# Altium project SAMV71_Xplained_Ultra.PrjPCB (part 5 of 5)

## Sheet SAMV71_Xplained_Ultra_Audio.SchDoc: Audio
size A3; Organization: ATMEL Norway; Address1: Vestre Rosten 79; Address2: N-7075 TILLER; Address3: NORWAY; DocumentNumber: A09-2407; Revision: 3; SheetNumber: 11; SheetTotal: 13; PageSetup: Record=PageOptions|CenterHorizontal=True|CenterVertical=True|PrintScale=1.01|XCorrection=1.00|YCorrection=1.00|PrintKind=1|BorderSize=5000000|LeftOffset=0|BottomOffset=0|Orientation=2|PaperLength=1000|PaperWidth=1000|Scale=100|PaperSource=7|PrintQuality=-4|MediaType=1|DitherType=10|PaperKind=A3 (297 x 420 mm)|PrintScaleMode=1
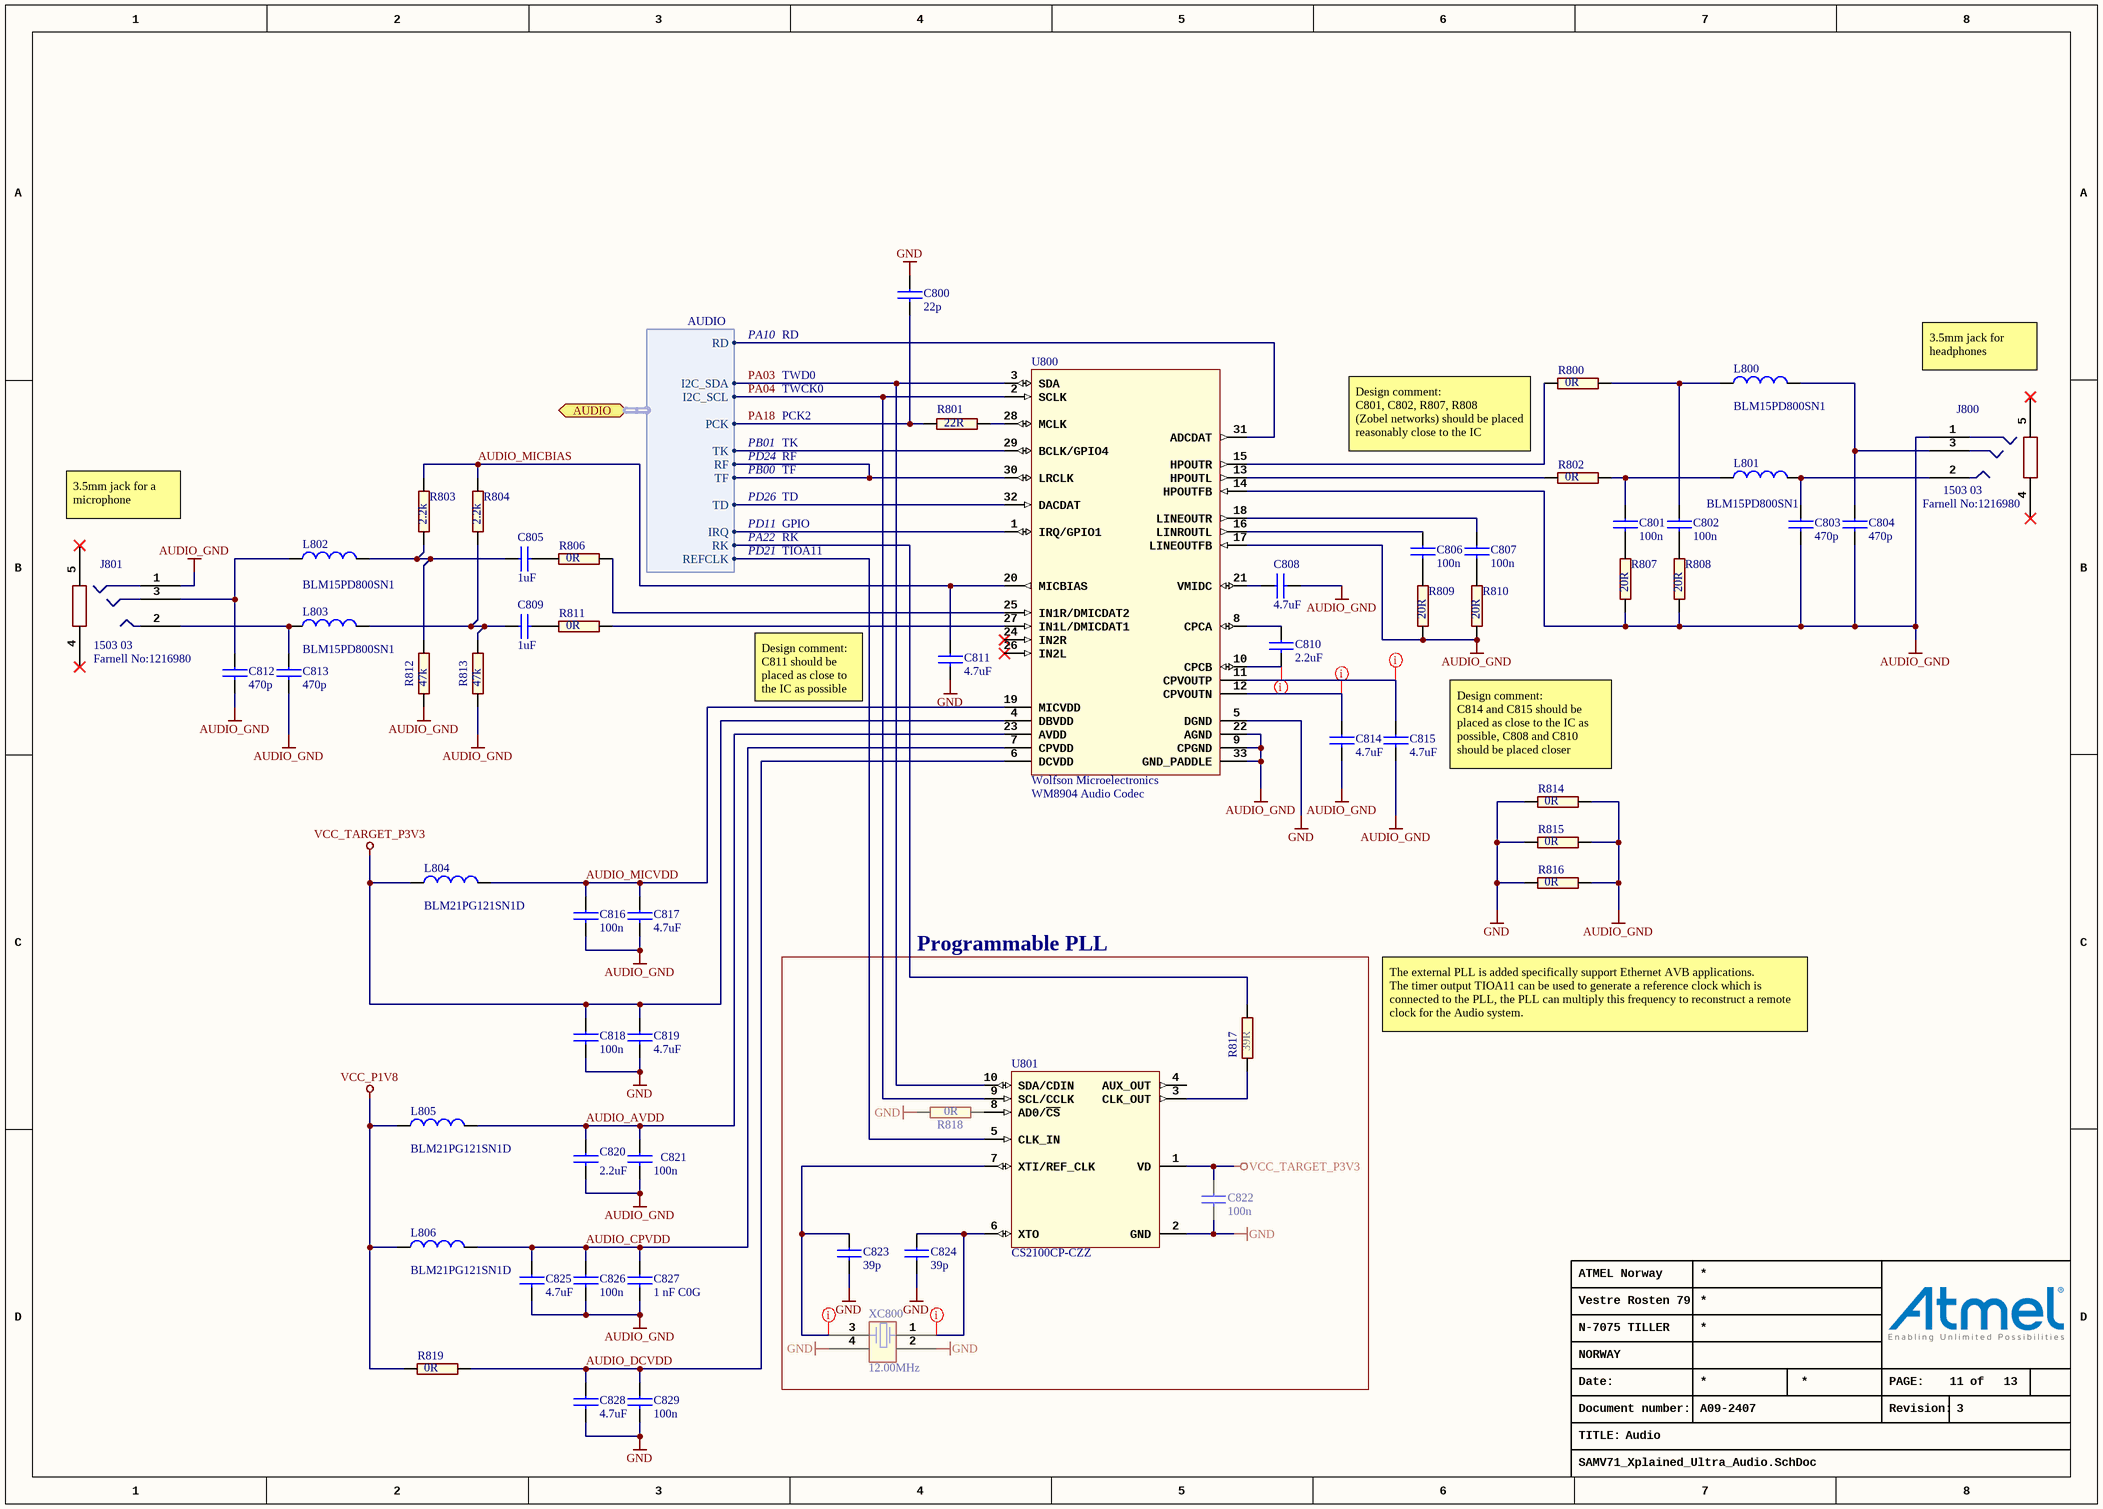
[diagram p10: SAMV71_Xplained_Ultra_Audio.SchDoc]

### Parts
C800  value 22p  [AP1-00001]
C801  value 100n  [AP1-00001]
C802  value 100n  [AP1-00001]
C803  value 470p  [AP1-00001]
C804  value 470p  [AP1-00001]
C805  value 1uF  [AP1-00038]
C806  value 100n  [AP1-00001]
C807  value 100n  [AP1-00001]
C808  value 4.7uF  [AP1-00039]
C809  value 1uF  [AP1-00038]
C810  value 2.2uF  [AP1-00001]  (hidden comment: Farnell no: 1288200)
C811  value 4.7uF  [AP1-00039]
C812  value 470p  [AP1-00001]
C813  value 470p  [AP1-00001]
C814  value 4.7uF  [AP1-00001]
C815  value 4.7uF  [AP1-00001]
C816  value 100n  [AP1-00001]
C817  value 4.7uF  [AP1-00039]
C818  value 100n  [AP1-00001]
C819  value 4.7uF  [AP1-00039]
C820  value 2.2uF  [AP1-00001]  (hidden comment: Farnell no: 1288200)
C821  value 100n  [AP1-00001]
C822  value 100n  [AP1-00001]
C823  value 39p  [AP1-00001]
C824  value 39p  [AP1-00001]
C825  value 4.7uF  [AP1-00039]
C826  value 100n  [AP1-00001]
C827  value 1 nF C0G  [AP1-00001]
C828  value 4.7uF  [AP1-00039]
C829  value 100n  [AP1-00001]
J800  Farnell No:1216980  value 1503 03  [AP8-00397]
J801  Farnell No:1216980  value 1503 03  [AP8-00397]
L800  value BLM15PD800SN1  [AP3-00028]
L801  value BLM15PD800SN1  [AP3-00028]
L802  value BLM15PD800SN1  [AP3-00028]
L803  value BLM15PD800SN1  [AP3-00028]
L804  value BLM21PG121SN1D  [AP3-00104]
L805  value BLM21PG121SN1D  [AP3-00104]
L806  value BLM21PG121SN1D  [AP3-00104]
R800  value 0R  [AP2-00000]
R801  value 22R  [AP2-00000]
R802  value 0R  [AP2-00000]
R803  value 2.2k  [AP2-00000]
R804  value 2.2k  [AP2-00000]
R806  value 0R  [AP2-00000]
R807  value 20R  [AP2-00000]
R808  value 20R  [AP2-00000]
R809  value 20R  [AP2-00000]
R810  value 20R  [AP2-00000]
R811  value 0R  [AP2-00000]
R812  value 47k  [AP2-00000]
R813  value 47k  [AP2-00000]
R814  value 0R  [AP2-00000]
R815  value 0R  [AP2-00000]
R816  value 0R  [AP2-00000]
R817  value 39R  [AP2-00000]
R818  value 0R  [AP2-00000]
R819  value 0R  [AP2-00000]
U800  Wolfson Microelectronics  value WM8904 Audio Codec  [AP6-00420]
U801  value CS2100CP-CZZ  [AP6-00097]
XC800  value 12.00MHz  [AP7-00039]

### Blocks framed on the sheet
Programmable PLL: C822-C824 R817 R818 U801 XC800

### Ports
AUDIO (harness AUDIO)

### Harnesses
AUDIO: I2C_SDA, I2C_SCL, PCK, TK, RK, TF, RD, TD, IRQ, REFCLK, RF

### Nets
AUDIO_GND: C803.2 C804.2 C808.2 C812.2 C813.2 C814.2 C815.2 C816.2 C817.2 C820.2 C821.2 C825.2 C826.2 C827.2 J800.1(GND) J801.1(GND) R807.1 R808.1 R809.1 R810.1 R812.1 R813.1 R814.2 R815.2 R816.2 U800.9(CPGND) U800.14(HPOUTFB) U800.17(LINEOUTFB) U800.22(AGND) U800.33(GND_PADDLE)
GND: C800.1 C811.2 C818.2 C819.2 C822.2 C823.2 C824.2 C828.2 C829.2 R814.1 R815.1 R816.1 R818.1 U800.5(DGND) U801.2(GND) XC800.2 XC800.4
VCC_P1V8: L805.1 L806.1 R819.1
VCC_TARGET_P3V3: C818.1 C819.1 C822.1 L804.1 U800.4(DBVDD) U801.1(VD)
AUDIO_AVDD: C820.1 C821.1 L805.2 U800.23(AVDD)
AUDIO_CPVDD: C825.1 C826.1 C827.1 L806.2 U800.7(CPVDD)
AUDIO_DCVDD: C828.1 C829.1 R819.2 U800.6(DCVDD)
AUDIO_MICBIAS: C811.1 R803.2 R804.2 U800.20(MICBIAS)
AUDIO_MICVDD: C816.1 C817.1 L804.2 U800.19(MICVDD)
PA03: U800.3(SDA) U801.10(SDA/CDIN) ; port AUDIO.I2C_SDA
PA04: U800.2(SCLK) U801.9(SCL/CCLK) ; port AUDIO.I2C_SCL
PA18: C800.2 R801.1 ; port AUDIO.PCK
NetC801_1: C801.1 L801.1 R802.2
NetC801_2: C801.2 R807.2
NetC802_1: C802.1 L800.1 R800.2
NetC802_2: C802.2 R808.2
NetC803_1: C803.1 J800.2 L801.2
NetC804_1: C804.1 J800.3 L800.2
NetC805_1: C805.1 L802.2 R803.1 R812.2
NetC805_2: C805.2 R806.1
NetC806_1: C806.1 U800.16(LINROUTL)
NetC806_2: C806.2 R809.2
NetC807_1: C807.1 U800.18(LINEOUTR)
NetC807_2: C807.2 R810.2
NetC808_1: C808.1 U800.21(VMIDC)
NetC809_1: C809.1 L803.2 R804.1 R813.2
NetC809_2: C809.2 R811.1
NetC810_1: C810.1 U800.8(CPCA)
NetC810_2: C810.2 U800.10(CPCB)
NetC812_1: C812.1 J801.3 L802.1
NetC813_1: C813.1 J801.2 L803.1
NetC814_1: C814.1 U800.12(CPVOUTN)
NetC815_1: C815.1 U800.11(CPVOUTP)
NetC823_1: C823.1 U801.7(XTI/REF_CLK) XC800.3
NetC824_1: C824.1 U801.6(XTO) XC800.1
NetR200_2: U800.1(IRQ/GPIO1) ; port AUDIO.IRQ
NetR223_2: U800.30(LRCLK) ; port AUDIO.TF, port AUDIO.RF
NetR224_2: U800.29(BCLK/GPIO4) ; port AUDIO.TK
NetR225_2: R817.2 ; port AUDIO.RK
NetR228_2: U800.31(ADCDAT) ; port AUDIO.RD
NetR229_2: U800.32(DACDAT) ; port AUDIO.TD
NetR230_2: U801.5(CLK_IN) ; port AUDIO.REFCLK
NetR800_1: R800.1 U800.15(HPOUTR)
NetR801_2: R801.2 U800.28(MCLK)
NetR802_1: R802.1 U800.13(HPOUTL)
NetR806_2: R806.2 U800.25(IN1R/DMICDAT2)
NetR811_2: R811.2 U800.27(IN1L/DMICDAT1)
NetR817_1: R817.1 U801.3(CLK_OUT)
NetR818_2: R818.2 U801.8(AD0/~{CS})

Not connected (* = marked no-connect by the designer): J800 4* 5*; J801 4* 5*; U800 24(IN2R)* 26(IN2L)*; U801 4(AUX_OUT)

### Layout directives
rule Assembly Testpoint Usage [Testpoint - Not Allowed    Multiple - Not Allowed]; rule Fabrication Testpoint Usage [Testpoint - Not Allowed    Multiple - Not Allowed]: NetC823_1, NetC824_1
rule Fabrication Testpoint Usage [Testpoint - Not Allowed    Multiple - Not Allowed]; rule Assembly Testpoint Usage [Testpoint - Not Allowed    Multiple - Not Allowed]: NetC810_2, NetC814_1, NetC815_1

### Notes on the sheet
- PA10
- RD
- TWD0
- 3.5mm jack for headphones
- PB01
- TWCK0
- PCK2
- TK
- Design comment:
  C801, C802, R807, R808
  (Zobel networks) should be placed reasonably close to the IC
- 3.5mm jack for a microphone
- PD24
- PB00
- PD26
- RF
- TF
- TD
- PA22
- PD21
- PD11
- GPIO
- RK
- TIOA11
- Design comment:
  C811 should be placed as close to the IC as possible
- Design comment:
  C814 and C815 should be placed as close to the IC as possible, C808 and C810 should be placed closer
- The external PLL is added specifically support Ethernet AVB applications.
  The timer output TIOA11 can be used to generate a reference clock which is
  connected to the PLL, the PLL can multiply this frequency to reconstruct a remote
  clock for the Audio system.
- Date:
- PAGE:
- of
- TITLE:
- Document number:
- Revision:

### Library data of the parts
C800 = A01-0019: Ceramic capacitor, SMD 0402, NP0, 50V, +/-5%; PartGroup: Capacitors,Ceramic,SMD 0402; TemperatureRange: -55 - +125 deg C; AN: A01-0019; Tolerance: 50V, +/-5%; Height: 0,550000011920929
C801 C802 C806 C807 C816 C818 C821 C822 C826 C829 = A01-0246: Ceramic capacitor, SMD 0402, X7R, 16V, +/-10%; PartGroup: Capacitors,Ceramic,SMD 0402; Manufacturer: Kemet; MPN: C0402C104K4RACTU; TemperatureRange: -55 - +125 deg C; AN: A01-0246; Tolerance: 16V, +/-10%; Height: 0,5
C803 C804 C812 C813 = A01-0034: Ceramic capacitor, SMD 0402, X7R, 50V, +/-10%; PartGroup: Capacitors,Ceramic,SMD 0402; TemperatureRange: -55 - +125 deg C; AN: A01-0034; Tolerance: 50V, +/-10%; Height: 0,550000011920929
C805 C809 = A01-0447: Ceramic capacitor, SMD 0402, X5R, 10V, ±10 %; PartGroup: Capacitors,Ceramic,SMD 0402; Manufacturer: AVX; MPN: 0402ZD105KAT2A; AN: A01-0447; Height: 0,560000002384186
C808 C811 C817 C819 C825 C828 = A01-0377: Ceramic capacitor, SMD 0603, X5R, 10V, 10% (de31036); PartGroup: Capacitors,Ceramic,SMD 0603; Manufacturer: tdk; MPN: C1608X5R1A475K; TemperatureRange: -55 - +85 deg C; AN: A01-0377; Tolerance: 10%; Height: 0,800000011920929
C810 C820 = A01-0300: Ceramic capacitor, SMD 0402, X5R, 6.3V, +/-20%; PartGroup: Capacitors,Ceramic,SMD 0402; Manufacturer: Kemet; MPN: C0402C225M9PAC; Tolerance: Â±20%; TemperatureRange: -55Â°C to +85Â°C; AN: A01-0300; Height: 0,5
C814 C815 = A01-0347: Ceramic capacitor, SMD 0402, X5R, 6.3V, +/-20% (de33687); PartGroup: Capacitors,Ceramic,SMD 0402; Manufacturer: Murata; MPN: GRM155R60J475ME87D; Tolerance: +-20%; TemperatureRange: -55°C to +85°C; AN: A01-0347; Height: 0,5
C823 C824 = A01-0022: Ceramic capacitor, SMD 0402, NP0, 50V, +/-5%; PartGroup: Capacitors,Ceramic,SMD 0402; TemperatureRange: -55 - +125 deg C; AN: A01-0022; Tolerance: 50V, +/-5%; Height: 0,550000011920929
C827 = A01-0321: Ceramic capacitor, SMD 0402, C0G, 50V, +/-5%; PartGroup: Capacitors,Ceramic,SMD 0402; Manufacturer: Murata; MPN: GRM1555C1H102JA01D; Tolerance: 5%; AN: A01-0321; Height: 0,550000011920929
J800 J801 = A08-0886: 3.5mm stereo phone jack; PartGroup: Mechanical devices,Connectors,Other; Manufacturer: Lumberg; AN: A08-0886; Height: 5; MPN: 1503 03
L800-L803 = A03-0142: FERRITE CHIP 80 OHM 1500MA 0402; PartGroup: Inductors,EMI; Manufacturer: Murata; Tolerance: ±25%; TemperatureRange: -55 ° C to +125 ° C; AN: A03-0142; Height: 0,5; MPN: BLM15PD800SN1
L804-L806 = A03-0167: SMD EMI FERRITE 0805, Z=120 ohm(@100MHz), Max R(dc)=0.03 ohm, Max current=3A, (Digikey:490-5986-2-ND); PartGroup: Inductors,EMI; Manufacturer: Murata; TemperatureRange: -55 to +125Â°C; AN: A03-0167; Height: 0,899999976158142; MPN: BLM21PG121SN1D
R800 R802 R806 R811 R814-R816 R818 R819 = A02-0163: RES 0.0 OHM 1/16W 0402 SMD; PartGroup: Resistors,SMD,0402 1%; Manufacturer: (n/a); MPN: RMCF0402ZT0R00; Tolerance: 1 %; TemperatureRange: -55 - +125 deg C; AN: A02-0163; Height: 0,349999994039536
R801 = A02-0172: Thick film resistor, SMD 0402, 1/16W, 1% (de23607); PartGroup: Resistors,SMD,0402 1%; Manufacturer: Samsung; MPN: RC100SF22R0CS; TemperatureRange: -55 - +125 deg C; AN: A02-0172; Tolerance: 1 %; Height: 0,349999994039536
R803 R804 = A02-0220: Thick film resistor, SMD 0402, 1/16W, 1%; PartGroup: Resistors,SMD,0402 1%; TemperatureRange: -55 - +125 deg C; AN: A02-0220; Tolerance: 1 %; Height: 0,349999994039536
R807-R810 = A02-0171: Thick film resistor, SMD 0402, 1/16W, 1%; PartGroup: Resistors,SMD,0402 1%; TemperatureRange: -55 - +125 deg C; AN: A02-0171; Tolerance: 1 %; Height: 0,349999994039536
R812 R813 = A02-0252: Thick film resistor, SMD 0402, 1/16W, 1%; PartGroup: Resistors,SMD,0402 1%; TemperatureRange: -55 - +125 deg C; AN: A02-0252; Tolerance: 1 %; Height: 0,349999994039536
R817 = A02-0178: Thick film resistor, SMD 0402, 1/16W, 1%; PartGroup: Resistors,SMD,0402 1%; TemperatureRange: -55 - +125 deg C; AN: A02-0178; Tolerance: 1 %; Height: 0,349999994039536
U800 = A06-1156: Ultra Low Power Codec for Portable Audio Applications; PartGroup: Integrated Circuits,Special function,Mixed signal; MPN: WM8904CGEFL/RV; TemperatureRange: -40C to +85C; AN: A06-1156; Height: 0,800000011920929; Manufacturer: Wolfson microelectronics
U801 = A06-1177: Programmable Phase-Locked Loop Clock Generator; PartGroup: Integrated Circuits,Special function,Oscillator; Manufacturer: CIRRUS LOGIC; MPN: CS2100CP-CZZR; TemperatureRange: -10Â°C to +70Â°C; AN: A06-1177; Height: 1,10000002384186
XC800 = A07-0042: Fox FQ5032B 12.0MHz SMD crystal 738B-12; PartGroup: Frequency devices,Crystals,SMD; Manufacturer: Fox  Electronics; MPN: FQ5032B-12.000; Tolerance: Â±30ppm; TemperatureRange: 0Â°C ~ 70Â°C; AN: A07-0042; Height: 1,20000004768372

## Sheet SAMV71_Xplained_Ultra_MCU_Peripherals.SchDoc: Target MCU Peripherals
size A3; Organization: ATMEL Norway; Address1: Vestre Rosten 79; Address2: N-7075 TILLER; Address3: NORWAY; DocumentNumber: A09-2407; Revision: 3; SheetNumber: 6; SheetTotal: 13; PageSetup: Record=PageOptions|CenterHorizontal=True|CenterVertical=True|PrintScale=1.01|XCorrection=1.00|YCorrection=1.00|PrintKind=1|BorderSize=5000000|LeftOffset=0|BottomOffset=0|Orientation=2|PaperLength=1000|PaperWidth=1000|Scale=100|PaperSource=7|PrintQuality=-4|MediaType=1|DitherType=10|PaperKind=A3 (297 x 420 mm)|PrintScaleMode=1
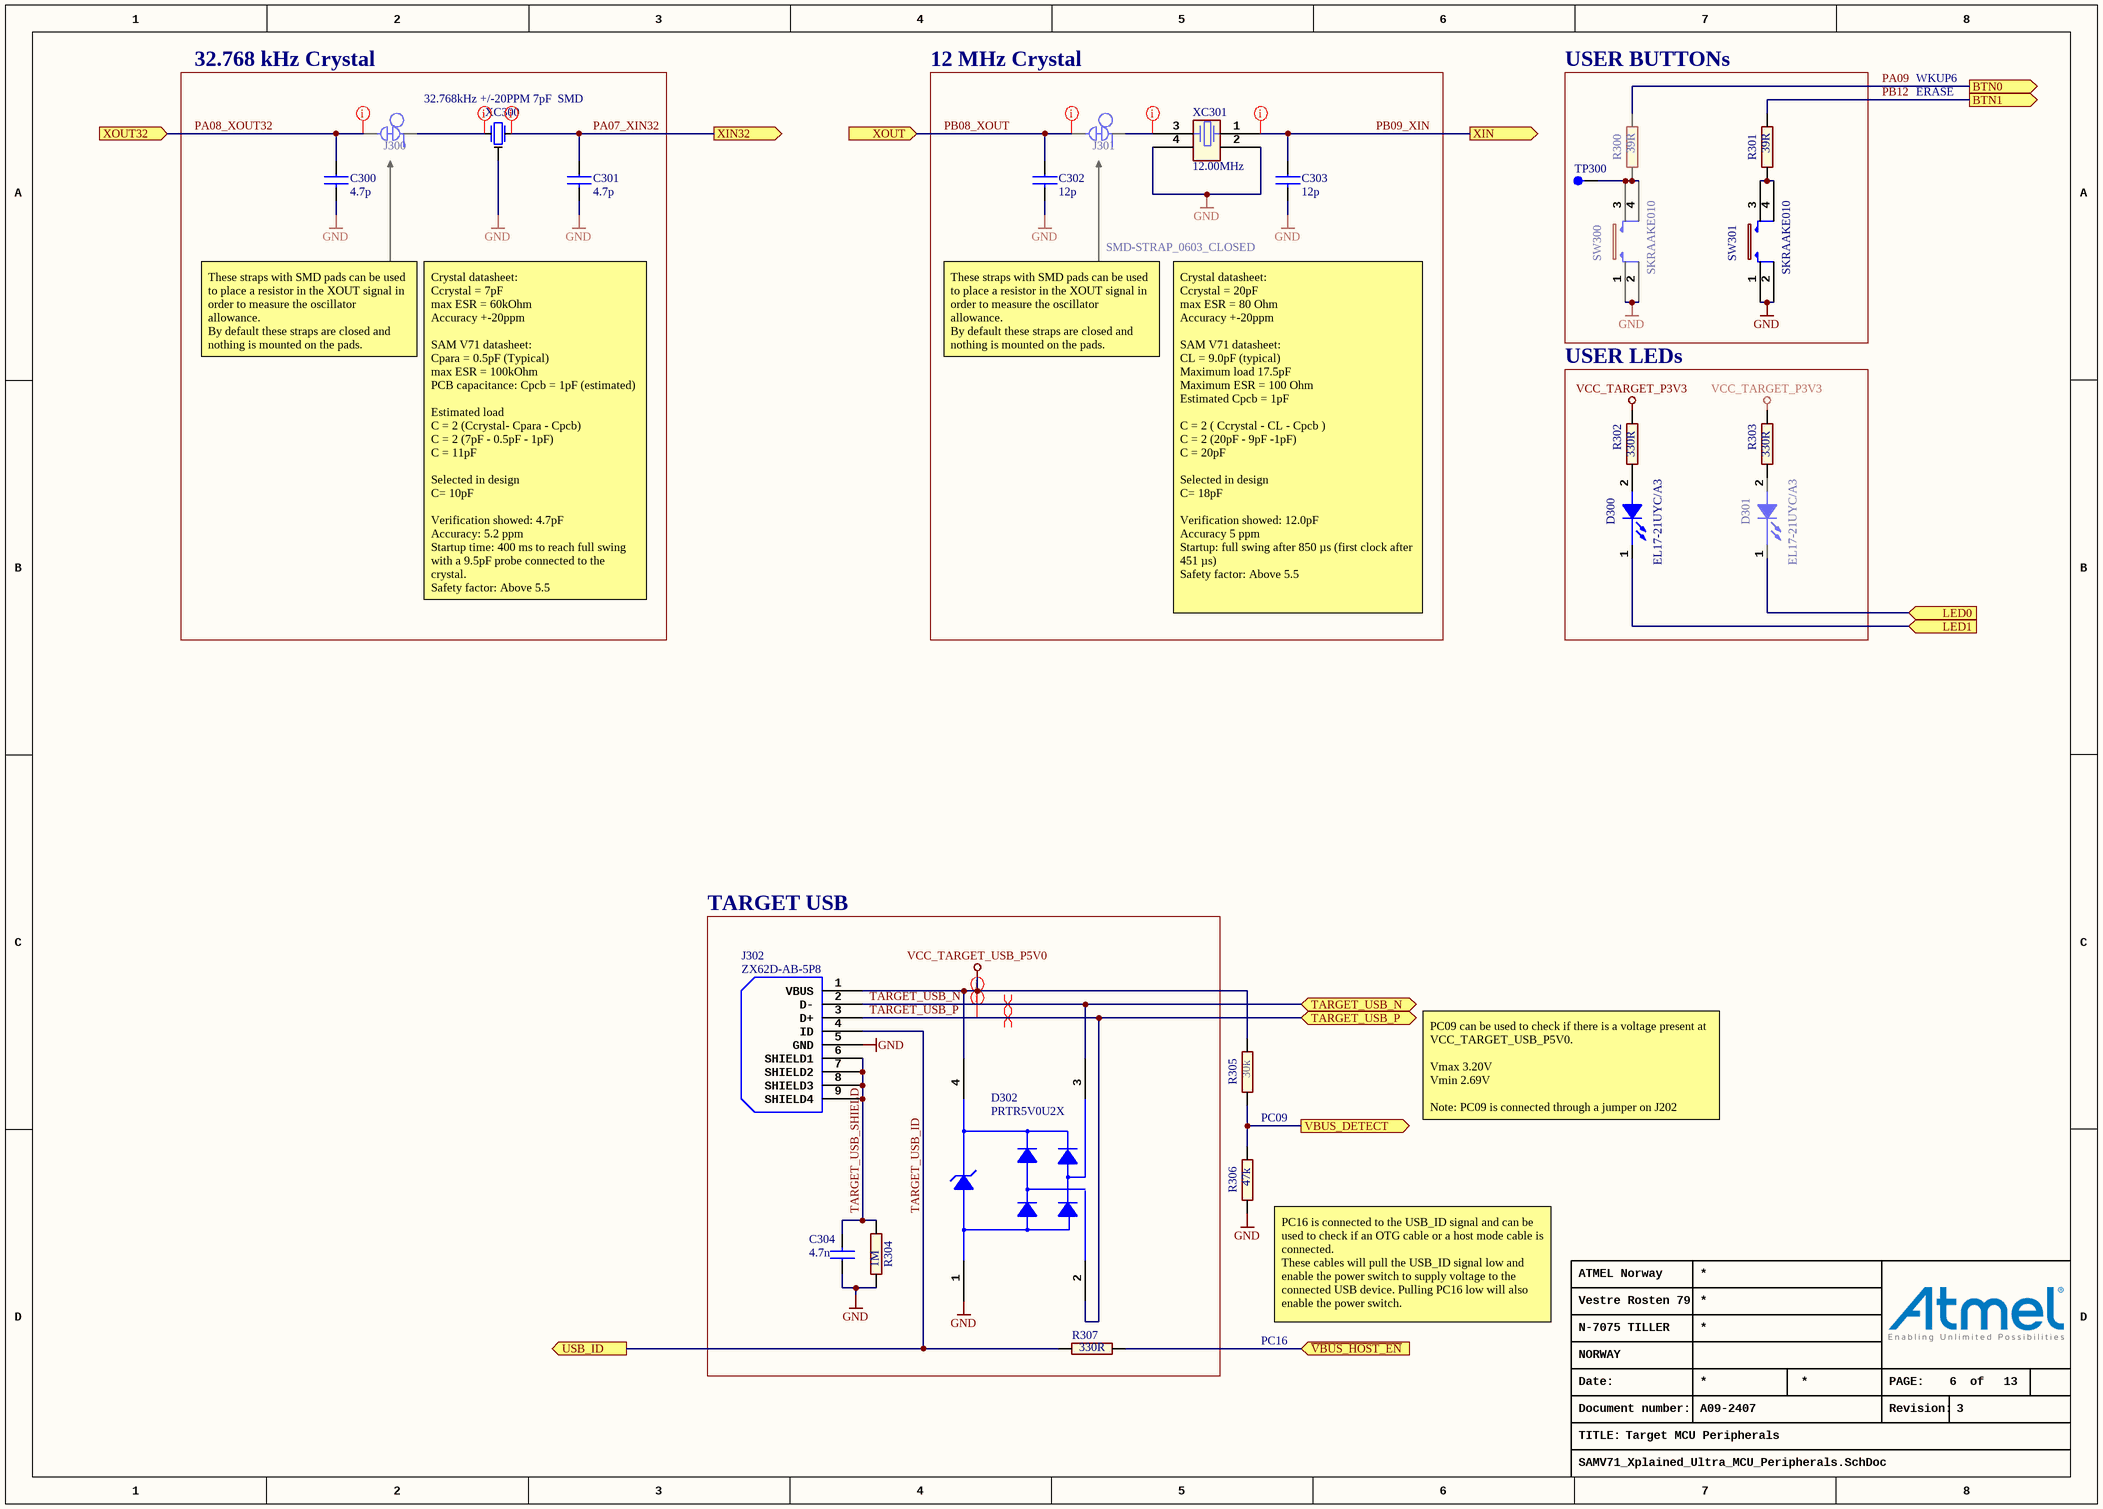
[diagram p11: SAMV71_Xplained_Ultra_MCU_Peripherals.SchDoc]

### Parts
C300  value 4.7p  [AP1-00001]
C301  value 4.7p  [AP1-00001]
C302  value 12p  [AP1-00001]
C303  value 12p  [AP1-00001]
C304  value 4.7n  [AP1-00053]
D300  value EL17-21UYC/A3  [AP4-00013]
D301  value EL17-21UYC/A3  [AP4-00013]
D302  value PRTR5V0U2X  [AP4-00001]
J300  (no value)  [AP9-00044]  (net tie, no BOM)
J301  value SMD-STRAP_0603_CLOSED  [AP9-00044]  (net tie, no BOM)
J302  value ZX62D-AB-5P8  [AP8-00852]  (hidden comment: 2,000 pieces per reel)
R300  value 39R  [AP2-00011]
R301  value 39R  [AP2-00011]
R302  value 330R  [AP2-00000]
R303  value 330R  [AP2-00000]
R304  value 1M  [AP2-00011]
R305  value 30k  [AP2-00000]
R306  value 47k  [AP2-00000]
R307  value 330R  [AP2-00000]
SW300  value SKRAAKE010  [AP8-00137]  (hidden comment: Can be ordered in low volumes from Mouser)
SW301  value SKRAAKE010  [AP8-00137]  (hidden comment: Can be ordered in low volumes from Mouser)
TP300  (no value)  [AP8-00010]  (no BOM)
XC300  value 32.768kHz +/-20PPM 7pF  SMD  [AP7-00044]  (hidden comment: Farnell order no:1539364)
XC301  value 12.00MHz  [AP7-00039]

### Blocks framed on the sheet
32.768 kHz Crystal: C300 C301 J300 XC300
12 MHz Crystal: C302 C303 J301 XC301
USER BUTTONs: R300 R301 SW300 SW301 TP300
USER LEDs: D300 D301 R302 R303
TARGET USB: C304 D302 J302 R304 R307

### Ports
BTN0 (out), BTN1 (out), LED0 (in), LED1 (in), TARGET_USB_N (bidir), TARGET_USB_P (bidir), USB_ID (out), VBUS_DETECT (out), XIN32 (out), XIN (out), XOUT32 (in), XOUT (in), ~{VBUS_HOST_EN} (in)

### Nets
GND: C300.2 C301.2 C302.2 C303.2 C304.1 D302.1(GND) J302.5(GND) R304.1 R306.1 SW300.1 SW300.2 SW301.1 SW301.2 XC300.3 XC301.2 XC301.4
VCC_TARGET_P3V3: R302.2 R303.2
VCC_TARGET_USB_P5V0: D302.4(VCC) J302.1(VBUS) R305.2
PA07_XIN32: C301.1 XC300.2 ; port XIN32
PA08_XOUT32: C300.1 J300.2 ; port XOUT32
PA09: R300.2 ; port BTN0
PA23: D301.1(CATHODE) ; port LED0
PB08_XOUT: C302.1 J301.2 ; port XOUT
PB09_XIN: C303.1 XC301.1 ; port XIN
PB12: R301.2 ; port BTN1
PC09_LED: D300.1(CATHODE) ; port LED1
PC09_VBUS_DETECT: R305.1 R306.2 ; port VBUS_DETECT
PC16: R307.2 ; port ~{VBUS_HOST_EN}
TARGET_USB_ID: J302.4(ID) R307.1 ; port USB_ID
TARGET_USB_N: D302.3(I/O_2) J302.2(D-) ; port TARGET_USB_N
TARGET_USB_P: D302.2(I/O_1) J302.3(D+) ; port TARGET_USB_P
TARGET_USB_SHIELD: C304.2 J302.6(SHIELD1) J302.7(SHIELD2) J302.8(SHIELD3) J302.9(SHIELD4) R304.2
NetD300_2: D300.2(ANODE) R302.1
NetD301_2: D301.2(ANODE) R303.1
NetJ300_1: J300.1 XC300.1
NetJ301_1: J301.1 XC301.3
NetR300_1: R300.1 SW300.3 SW300.4 TP300.1
NetR301_1: R301.1 SW301.3 SW301.4

### Layout directives
differential pair: TARGET_USB_N, TARGET_USB_P
rule Assembly Testpoint Usage [Testpoint - Not Allowed    Multiple - Not Allowed]; rule Fabrication Testpoint Usage [Testpoint - Not Allowed    Multiple - Not Allowed]: NetJ300_1, NetJ301_1, PA07_XIN32, PA08_XOUT32, PB08_XOUT, PB09_XIN, TARGET_USB_N, TARGET_USB_P

### Notes on the sheet
- WKUP6
- ERASE
- These straps with SMD pads can be used to place a resistor in the XOUT signal in order to measure the oscillator allowance.
  By default these straps are closed and nothing is mounted on the pads.
- Crystal datasheet:
  Ccrystal = 7pF
  max ESR = 60kOhm
  Accuracy +-20ppm
  SAM V71 datasheet:
  Cpara = 0.5pF (Typical)
  max ESR = 100kOhm
  PCB capacitance: Cpcb = 1pF (estimated)
  Estimated load
  C = 2 (Ccrystal- Cpara - Cpcb)
  C = 2 (7pF - 0.5pF - 1pF)
  C = 11pF
  Selected in design
  C= 10pF
  Verification showed: 4.7pF
  Accuracy: 5.2 ppm
  Startup time: 400 ms to reach full swing with a 9.5pF probe connected to the crystal.
  Safety factor: Above 5.5
- Crystal datasheet:
  Ccrystal = 20pF
  max ESR = 80 Ohm
  Accuracy +-20ppm
  SAM V71 datasheet:
  CL = 9.0pF (typical)
  Maximum load 17.5pF
  Maximum ESR = 100 Ohm
  Estimated Cpcb = 1pF
  C = 2 ( Ccrystal - CL - Cpcb )
  C = 2 (20pF - 9pF -1pF)
  C = 20pF
  Selected in design
  C= 18pF
  Verification showed: 12.0pF
  Accuracy 5 ppm
  Startup: full swing after 850 µs (first clock after 451 µs)
  Safety factor: Above 5.5
- PC09
- PC09 can be used to check if there is a voltage present at VCC_TARGET_USB_P5V0.
  Vmax 3.20V
  Vmin 2.69V
  Note: PC09 is connected through a jumper on J202
- (near R306) PC16 is connected to the USB_ID signal and can be used to check if an OTG cable or a host mode cable is connected.
  These cables will pull the USB_ID signal low and enable the power switch to supply voltage to the connected USB device. Pulling PC16 low will also enable the power switch.
- PC16
- Date:
- PAGE:
- of
- TITLE:
- Document number:
- Revision:

### Library data of the parts
C300 C301 = A01-0011: Ceramic capacitor, SMD 0402, NP0, 50V, +/-0.25pF; PartGroup: Capacitors,Ceramic,SMD 0402; TemperatureRange: -55 - +125 deg C; AN: A01-0011; Tolerance: 50V, +/-0.25pF; Height: 0,550000011920929
C302 C303 = A01-0016: Ceramic capacitor, SMD 0402, NP0, 50V, +/-5%; PartGroup: Capacitors,Ceramic,SMD 0402; TemperatureRange: -55 - +125 deg C; AN: A01-0016; Tolerance: 50V, +/-5%; Height: 0,550000011920929
C304 = A01-0046: Ceramic capacitor, SMD 0402, X7R, 25V, +/-10%; PartGroup: Capacitors,Ceramic,SMD 0402; TemperatureRange: -55 - +125 deg C; AN: A01-0046; Tolerance: 25V, +/-10%; Height: 0,550000011920929
D300 D301 = A10-0019: LED, Yellow, Wave length=591nm, SMD 0805, ±70°; PartGroup: Opto,LEDs,SMD; Manufacturer: Everlight; MPN: 17-21UYC/S530-A3/TR8; TemperatureRange: -40 to +85 deg C; AN: A10-0019; Height: 1,10000002384186
D302 = A06-0236: Double rail-to-rail USB ESD protection diode; OrcadPartType: Integrated Circuits&Special function&Protection; Manufacturer: NXP; PartGroup: Integrated Circuits,Special function,Protection; TemperatureRange: -40 to +85 C; AN: A06-0236; PartType: Buy; Height: 1,10000002384186; MPN: PRTR5V0U2X
J300 = A09-0783: Default closed SMD strap, 0603 size; PartGroup: Mechanical devices,PCB implemented components; Value: SMD-STRAP_0603_CLOSED; AN: A09-0783; Height: 0
J301 = A09-0783: Default closed SMD strap, 0603 size; PartGroup: Mechanical devices,PCB implemented components; AN: A09-0783; Height: 0
J302 = A08-2112: Micro USB AB Connector, Standard SMT + DIP; PartGroup: Mechanical devices,Connectors,USB; Manufacturer: HIROSE; AN: A08-2112; Height: 2,79999995231628; MPN: ZX62D-AB-5P8
R300 R301 = A02-0178: as R817 on sheet SAMV71_Xplained_Ultra_Audio; AN: A02-0178; Tolerance: 1 %; Height: 0,349999994039536
R302 R303 R307 = A02-0200: Thick film resistor, SMD 0402, 1/16W, 1%; PartGroup: Resistors,SMD,0402 1%; TemperatureRange: -55 - +125 deg C; AN: A02-0200; Tolerance: 1 %; Height: 0,349999994039536
R304 = A02-0284: Thick film resistor, SMD 0402, 1/16W, 1%; PartGroup: Resistors,SMD,0402 1%; TemperatureRange: -55 - +125 deg C; AN: A02-0284; Tolerance: 1 %; Height: 0,349999994039536
R305 = A02-0247: Thick film resistor, SMD 0402, 1/16W, 1%; PartGroup: Resistors,SMD,0402 1%; TemperatureRange: -55ï¿½ to +155ï¿½C; AN: A02-0247; Tolerance: 1 %; Height: 0,349999994039536
R306 = A02-0252: as R812 on sheet SAMV71_Xplained_Ultra_Audio; AN: A02-0252; Tolerance: 1 %; Height: 0,349999994039536
SW300 SW301 = A08-0790: 6.2x6.2 mm SMD tact switch, same as A08-0091 but less force is needed; PartGroup: Mechanical devices,Switches,SMD; Manufacturer: ALPS; TemperatureRange: -30 - +90 deg C; AN: A08-0790; Height: 5,09999990463257; MPN: SKRAAKE010
TP300 = A08-0004: Single SMD testpad; PartGroup: Mechanical devices,Connectors,Test points; AN: A08-0004; Height: 0; Value: TESTPAD
XC300 = A07-0052: 32k768 crystal, +-20ppm, CL=7pF, max ESR 60kOhm, SMD; PartGroup: Frequency devices,Crystals,SMD; Manufacturer: Micro Crystal; MPN: MS1V-T1K 32.768kHz 7pF +/-20PPM TA; Tolerance: +/- 20 PPM; TemperatureRange: -40 /+85; AN: A07-0052; Height: 2,07999992370605
XC301 = A07-0042: as XC800 on sheet SAMV71_Xplained_Ultra_Audio; AN: A07-0042; Height: 1,20000004768372

## Sheet SAMV71_Xplained_Ultra_CAN.SchDoc: CAN
size A3; Organization: ATMEL Norway; Address1: Vestre Rosten 79; Address2: N-7075 TILLER; Address3: NORWAY; DocumentNumber: A09-2407; Revision: 3; SheetNumber: 12; SheetTotal: 13; PageSetup: Record=PageOptions|CenterHorizontal=True|CenterVertical=True|PrintScale=1.01|XCorrection=1.00|YCorrection=1.00|PrintKind=1|BorderSize=5000000|LeftOffset=0|BottomOffset=0|Orientation=2|PaperLength=1000|PaperWidth=1000|Scale=100|PaperSource=7|PrintQuality=-4|MediaType=1|DitherType=10|PaperKind=A3 (297 x 420 mm)|PrintScaleMode=1; ProjectName: SAM3X Xplained Pro
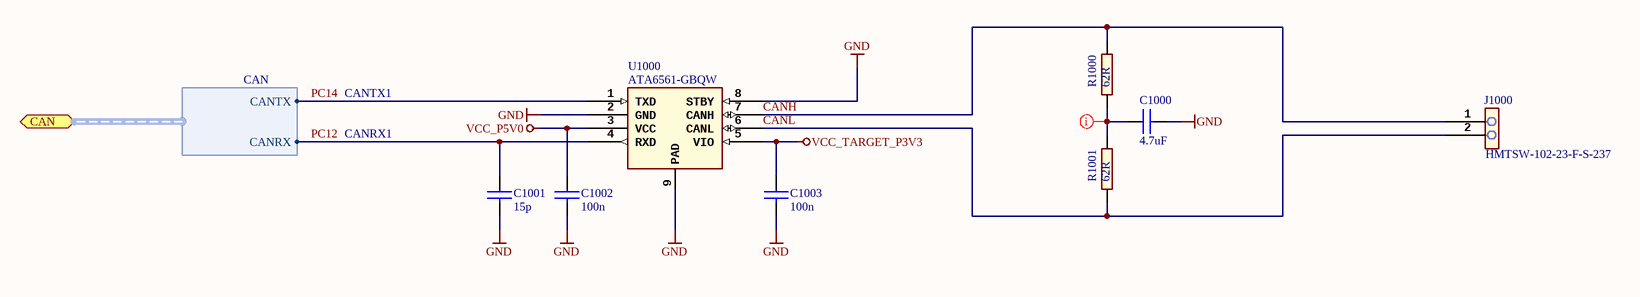
[diagram p12: SAMV71_Xplained_Ultra_CAN.SchDoc]

### Parts
C1000  value 4.7uF  [AP1-00003]
C1001  value 15p  [AP1-00001]
C1002  value 100n  [AP1-00001]
C1003  value 100n  [AP1-00001]
J1000  value HMTSW-102-23-F-S-237  [AP8-00733]
R1000  value 62R  [AP2-00008]  (hidden comment: Generic component)
R1001  value 62R  [AP2-00008]  (hidden comment: Generic component)
U1000  value ATA6561-GBQW  [AP6-00407]

### Ports
CAN (harness CAN)

### Harnesses
CAN: CANTX, CANRX

### Nets
GND: C1000.2 C1001.2 C1002.2 C1003.2 U1000.2(GND) U1000.8(STBY) U1000.9(PAD)
VCC_P5V0: C1002.1 U1000.3(VCC)
VCC_TARGET_P3V3: C1003.1 U1000.5(VIO)
CANH: J1000.1 R1000.2 U1000.7(CANH)
CANL: J1000.2 R1001.1 U1000.6(CANL)
PC12: C1001.1 U1000.4(RXD) ; port CAN.CANRX
PC14: U1000.1(TXD) ; port CAN.CANTX
NetC1000_1: C1000.1 R1000.1 R1001.2

### Layout directives
rule Fabrication Testpoint Usage [Testpoint - Not Allowed    Multiple - Not Allowed]; rule Assembly Testpoint Usage [Testpoint - Not Allowed    Multiple - Not Allowed]: NetC1000_1

### Notes on the sheet
- CANTX1
- CANRX1
- Date:
- PAGE:
- of
- TITLE:
- Document number:
- Revision:

### Library data of the parts
C1000 = A01-0400: Ceramic capacitor, SMD 0805, X5R, 25V, ±10 %; PartGroup: Capacitors,Ceramic,SMD 0805; Manufacturer: Murata; MPN: GRM21BR61E475KA12L; Tolerance: Â±10%; AN: A01-0400; Height: 1,25
C1001 = A01-0017: Ceramic capacitor, SMD 0402, NP0, 50V, +/-5%; PartGroup: Capacitors,Ceramic,SMD 0402; TemperatureRange: -55 - +125 deg C; AN: A01-0017; Tolerance: 50V, +/-5%; Height: 0,550000011920929
C1002 C1003 = A01-0246: as C801 on sheet SAMV71_Xplained_Ultra_Audio; AN: A01-0246; Tolerance: 16V, +/-10%; Height: 0,5
J1000 = A08-1754: 1x2 pin header, 2.54mm pitch, Pin-in-Paste THM; PartGroup: Mechanical devices,Connectors,Pin headers; Manufacturer: SAMTEC; TemperatureRange: - 55 deg C to + 125 deg C; AN: A08-1754; Height: 6,09999990463257; MPN: HMTSW-102-23-F-S-237
R1000 R1001 = A02-0760: Thick film resistor, SMD 1210, 0.5W, 1%; PartGroup: Resistors,SMD,1210 1%; TemperatureRange: -55°C to +155°C; AN: A02-0760; Tolerance: 1%; Height: 0,699999988079071
U1000 = A06-1172: 5Mbit/s CAN Trasceiver,VCC = 5V, VIO = 2.8-5V, 3x3 mm VDFN8; PartGroup: Integrated Circuits,Interface ICs,CAN; Manufacturer: ATMEL; AN: A06-1172; Height: 0,899999976158142; MPN: ATA6561-GBQW

## Nets that join several sheets
GND: SAMV71_Xplained_Ultra_Target_MCU (28 pins), SAMV71_Xplained_Ultra_EDBG (35 pins), SAMV71_Xplained_Ultra_Connectors (40 pins), SAMV71_Xplained_Ultra_Power_Supply (35 pins), SAMV71_Xplained_Ultra_Power_Multiplexer (9 pins), SAMV71_Xplained_Ultra_Power_Converter (24 pins), SAMV71_Xplained_Ultra_Ethernet (27 pins), SAMV71_Xplained_Ultra_Memory (33 pins), SAMV71_Xplained_Ultra_Shield_Connectors (6 pins), SAMV71_Xplained_Ultra_Audio (17 pins), SAMV71_Xplained_Ultra_MCU_Peripherals (16 pins), SAMV71_Xplained_Ultra_CAN (7 pins)
VCC_BACKUP_P3V3: SAMV71_Xplained_Ultra_Power_Supply (J102.2 R106.2 U101.1), SAMV71_Xplained_Ultra_Power_Converter (Q106.2 R127.2)
VCC_EDBG_P3V3: SAMV71_Xplained_Ultra_EDBG (24 pins), SAMV71_Xplained_Ultra_Power_Supply (Q101.2 Q108.2 R141.2)
VCC_EDBG_USB_P5V0: SAMV71_Xplained_Ultra_EDBG (C908.1 L900.2 U900.A10), SAMV71_Xplained_Ultra_Power_Multiplexer (C105.1 R116.2 U102.3 U102.8)
VCC_EXT_P5V0_P14V0: SAMV71_Xplained_Ultra_Connectors (J405.40), SAMV71_Xplained_Ultra_Power_Supply (6 pins), SAMV71_Xplained_Ultra_Shield_Connectors (J501.8)
VCC_IN_P5V0: SAMV71_Xplained_Ultra_Power_Supply (5 pins), SAMV71_Xplained_Ultra_Power_Multiplexer (Q104.3 R115.2 U102.2)
VCC_MCU_P3V3: SAMV71_Xplained_Ultra_Target_MCU (18 pins), SAMV71_Xplained_Ultra_Power_Supply (J102.1)
VCC_P1V2: SAMV71_Xplained_Ultra_Power_Converter (C120.1 R132.2 U104.23), SAMV71_Xplained_Ultra_Ethernet (6 pins)
VCC_P1V8: SAMV71_Xplained_Ultra_Power_Supply (R136.2), SAMV71_Xplained_Ultra_Power_Converter (C119.1 R128.2 U104.20), SAMV71_Xplained_Ultra_Audio (L805.1 L806.1 R819.1)
VCC_P3V3: SAMV71_Xplained_Ultra_EDBG (R920.2), SAMV71_Xplained_Ultra_Power_Supply (R100.1), SAMV71_Xplained_Ultra_Power_Converter (C116.1 C117.1 L102.2 R124.2)
VCC_P5V0: SAMV71_Xplained_Ultra_Power_Supply (5 pins), SAMV71_Xplained_Ultra_Power_Multiplexer (5 pins), SAMV71_Xplained_Ultra_Power_Converter (16 pins), SAMV71_Xplained_Ultra_Shield_Connectors (J501.5 J506.2 J507.1 J507.2), SAMV71_Xplained_Ultra_CAN (C1002.1 U1000.3)
VCC_TARGET_P3V3: SAMV71_Xplained_Ultra_Target_MCU (J200.1 R231.1 R232.1), SAMV71_Xplained_Ultra_Connectors (13 pins), SAMV71_Xplained_Ultra_Power_Supply (J101.4 R100.2 R102.2 U101.2), SAMV71_Xplained_Ultra_Power_Multiplexer (R120.1 R121.2), SAMV71_Xplained_Ultra_Power_Converter (R134.2), SAMV71_Xplained_Ultra_Ethernet (17 pins), SAMV71_Xplained_Ultra_Memory (38 pins), SAMV71_Xplained_Ultra_Shield_Connectors (J501.2 J501.4), SAMV71_Xplained_Ultra_Audio (6 pins), SAMV71_Xplained_Ultra_MCU_Peripherals (R302.2 R303.2), SAMV71_Xplained_Ultra_CAN (C1003.1 U1000.5)
VCC_TARGET_USB_P5V0: SAMV71_Xplained_Ultra_Power_Multiplexer (C106.1 R117.2 U102.6 U103.1), SAMV71_Xplained_Ultra_MCU_Peripherals (D302.4 J302.1 R305.2)
ADVREF: SAMV71_Xplained_Ultra_Target_MCU (C218.1 L200.2 U200.9), SAMV71_Xplained_Ultra_Shield_Connectors (J500.8)
EDBG_ADC0: SAMV71_Xplained_Ultra_EDBG (U900.K10), SAMV71_Xplained_Ultra_Power_Supply (R102.1 R103.2)
EDBG_TARGET_RESET: SAMV71_Xplained_Ultra_EDBG (U900.B4), SAMV71_Xplained_Ultra_Power_Supply (Q101.3)
ID1: SAMV71_Xplained_Ultra_EDBG (R903.1 U900.A1), SAMV71_Xplained_Ultra_Connectors (J401.1)
ID2: SAMV71_Xplained_Ultra_EDBG (R902.1 U900.B2), SAMV71_Xplained_Ultra_Connectors (J402.1)
ID4: SAMV71_Xplained_Ultra_EDBG (R901.1 U900.D3), SAMV71_Xplained_Ultra_Connectors (J404.1)
NetJ400_18: SAMV71_Xplained_Ultra_Target_MCU (R214.1), SAMV71_Xplained_Ultra_Connectors (J400.18)
NetJ401_13: SAMV71_Xplained_Ultra_Target_MCU (R201.2), SAMV71_Xplained_Ultra_Connectors (J401.13)
NetJ401_14: SAMV71_Xplained_Ultra_Target_MCU (R202.2), SAMV71_Xplained_Ultra_Connectors (J401.14)
NetJ401_18: SAMV71_Xplained_Ultra_Target_MCU (R204.2), SAMV71_Xplained_Ultra_Connectors (J401.18)
NetJ402_8: SAMV71_Xplained_Ultra_Target_MCU (R209.2), SAMV71_Xplained_Ultra_Connectors (J402.8)
NetJ402_18: SAMV71_Xplained_Ultra_Target_MCU (R212.2), SAMV71_Xplained_Ultra_Connectors (J402.18)
NetJ404_44: SAMV71_Xplained_Ultra_Target_MCU (R203.1), SAMV71_Xplained_Ultra_Connectors (J404.44)
NetJ500_6: SAMV71_Xplained_Ultra_Target_MCU (R205.2), SAMV71_Xplained_Ultra_Shield_Connectors (J500.6)
NetJ502_1: SAMV71_Xplained_Ultra_Target_MCU (R215.2), SAMV71_Xplained_Ultra_Shield_Connectors (J502.1)
NetJ502_6: SAMV71_Xplained_Ultra_Target_MCU (R216.2), SAMV71_Xplained_Ultra_Shield_Connectors (J502.6)
NetJ502_7: SAMV71_Xplained_Ultra_Target_MCU (R217.2), SAMV71_Xplained_Ultra_Shield_Connectors (J502.7)
NetJ502_8: SAMV71_Xplained_Ultra_Target_MCU (R218.2), SAMV71_Xplained_Ultra_Shield_Connectors (J502.8)
NetJ504_1: SAMV71_Xplained_Ultra_Target_MCU (R219.2), SAMV71_Xplained_Ultra_Shield_Connectors (J504.1)
NetJ504_2: SAMV71_Xplained_Ultra_Target_MCU (R220.2), SAMV71_Xplained_Ultra_Shield_Connectors (J504.2)
NetJ504_3: SAMV71_Xplained_Ultra_Target_MCU (R221.2), SAMV71_Xplained_Ultra_Shield_Connectors (J504.3)
NetJ504_4: SAMV71_Xplained_Ultra_Target_MCU (R222.2), SAMV71_Xplained_Ultra_Shield_Connectors (J504.4)
NetJ505_6: SAMV71_Xplained_Ultra_Target_MCU (R234.2), SAMV71_Xplained_Ultra_Shield_Connectors (J505.6)
NetJ505_7: SAMV71_Xplained_Ultra_Target_MCU (R208.2), SAMV71_Xplained_Ultra_Shield_Connectors (J505.7)
NetJ505_8: SAMV71_Xplained_Ultra_Target_MCU (R207.2), SAMV71_Xplained_Ultra_Shield_Connectors (J505.8)
NetJ506_3: SAMV71_Xplained_Ultra_Target_MCU (R227.2), SAMV71_Xplained_Ultra_Shield_Connectors (J506.3)
NetJ507_4: SAMV71_Xplained_Ultra_Target_MCU (R211.2), SAMV71_Xplained_Ultra_Shield_Connectors (J507.4)
NetJ507_5: SAMV71_Xplained_Ultra_Target_MCU (R213.2), SAMV71_Xplained_Ultra_Shield_Connectors (J507.5)
NetR200_2: SAMV71_Xplained_Ultra_Target_MCU (R200.2), SAMV71_Xplained_Ultra_Audio (U800.1)
NetR206_1: SAMV71_Xplained_Ultra_Target_MCU (R206.1), SAMV71_Xplained_Ultra_EDBG (U900.J4)
NetR223_2: SAMV71_Xplained_Ultra_Target_MCU (R223.2 R226.2), SAMV71_Xplained_Ultra_Audio (U800.30)
NetR224_2: SAMV71_Xplained_Ultra_Target_MCU (R224.2), SAMV71_Xplained_Ultra_Audio (U800.29)
NetR225_2: SAMV71_Xplained_Ultra_Target_MCU (R225.2), SAMV71_Xplained_Ultra_Audio (R817.2)
NetR228_2: SAMV71_Xplained_Ultra_Target_MCU (R228.2), SAMV71_Xplained_Ultra_Audio (U800.31)
NetR229_2: SAMV71_Xplained_Ultra_Target_MCU (R229.2), SAMV71_Xplained_Ultra_Audio (U800.32)
NetR230_2: SAMV71_Xplained_Ultra_Target_MCU (R230.2), SAMV71_Xplained_Ultra_Audio (U801.5)
~{PHY_RESET}: SAMV71_Xplained_Ultra_Target_MCU (U200.90), SAMV71_Xplained_Ultra_Ethernet (C713.1 R702.1 U700.28)
PA00: SAMV71_Xplained_Ultra_Target_MCU (U200.102), SAMV71_Xplained_Ultra_Connectors (J401.7), SAMV71_Xplained_Ultra_Shield_Connectors (J503.3)
PA01: SAMV71_Xplained_Ultra_Target_MCU (U200.99), SAMV71_Xplained_Ultra_Power_Converter (R134.1 U104.3)
PA02: SAMV71_Xplained_Ultra_Target_MCU (U200.93), SAMV71_Xplained_Ultra_EDBG (R914.1), SAMV71_Xplained_Ultra_Connectors (J402.9 J404.45 J405.16), SAMV71_Xplained_Ultra_Shield_Connectors (J503.8)
PA03: SAMV71_Xplained_Ultra_Target_MCU (R232.2 U200.91), SAMV71_Xplained_Ultra_EDBG (U900.G7), SAMV71_Xplained_Ultra_Connectors (5 pins), SAMV71_Xplained_Ultra_Memory (U600.5 U602.5 U603.5), SAMV71_Xplained_Ultra_Shield_Connectors (J500.9), SAMV71_Xplained_Ultra_Audio (U800.3 U801.10)
PA04: SAMV71_Xplained_Ultra_Target_MCU (R231.2 U200.77), SAMV71_Xplained_Ultra_EDBG (U900.F7), SAMV71_Xplained_Ultra_Connectors (5 pins), SAMV71_Xplained_Ultra_Memory (U600.6 U602.6 U603.6), SAMV71_Xplained_Ultra_Shield_Connectors (J500.10), SAMV71_Xplained_Ultra_Audio (U800.2 U801.9)
PA05: SAMV71_Xplained_Ultra_Target_MCU (U200.73), SAMV71_Xplained_Ultra_Connectors (J400.22 J401.10), SAMV71_Xplained_Ultra_Shield_Connectors (J500.1)
PA06: SAMV71_Xplained_Ultra_Target_MCU (U200.114), SAMV71_Xplained_Ultra_Connectors (J400.10 J402.5 J405.25), SAMV71_Xplained_Ultra_Shield_Connectors (J503.4)
PA07_XIN32: SAMV71_Xplained_Ultra_Target_MCU (U200.35), SAMV71_Xplained_Ultra_MCU_Peripherals (C301.1 XC300.2)
PA08_XOUT32: SAMV71_Xplained_Ultra_Target_MCU (U200.36), SAMV71_Xplained_Ultra_MCU_Peripherals (C300.1 J300.2)
PA09: SAMV71_Xplained_Ultra_Target_MCU (U200.75), SAMV71_Xplained_Ultra_EDBG (R911.1), SAMV71_Xplained_Ultra_Connectors (J400.21), SAMV71_Xplained_Ultra_MCU_Peripherals (R300.2)
PA11: SAMV71_Xplained_Ultra_Target_MCU (U200.64), SAMV71_Xplained_Ultra_Memory (R605.2 U604.1)
PA12: SAMV71_Xplained_Ultra_Target_MCU (U200.68), SAMV71_Xplained_Ultra_Memory (U604.2)
PA13: SAMV71_Xplained_Ultra_Target_MCU (U200.42), SAMV71_Xplained_Ultra_Memory (U604.5)
PA14: SAMV71_Xplained_Ultra_Target_MCU (U200.51), SAMV71_Xplained_Ultra_Memory (U604.6)
PA15: SAMV71_Xplained_Ultra_Target_MCU (U200.49), SAMV71_Xplained_Ultra_Connectors (J404.20), SAMV71_Xplained_Ultra_Memory (U601.B1)
PA16: SAMV71_Xplained_Ultra_Target_MCU (U200.45), SAMV71_Xplained_Ultra_Connectors (J404.21), SAMV71_Xplained_Ultra_Memory (U601.A2)
PA17: SAMV71_Xplained_Ultra_Target_MCU (U200.25), SAMV71_Xplained_Ultra_Memory (U604.3)
PA18: SAMV71_Xplained_Ultra_Target_MCU (U200.24), SAMV71_Xplained_Ultra_Shield_Connectors (J507.3), SAMV71_Xplained_Ultra_Audio (C800.2 R801.1)
PA19: SAMV71_Xplained_Ultra_Target_MCU (U200.23), SAMV71_Xplained_Ultra_Connectors (J401.4), SAMV71_Xplained_Ultra_Ethernet (R706.1 R720.1 U700.29), SAMV71_Xplained_Ultra_Shield_Connectors (J502.3)
PA20: SAMV71_Xplained_Ultra_Target_MCU (U200.22), SAMV71_Xplained_Ultra_Memory (U601.M1)
PA21: SAMV71_Xplained_Ultra_Target_MCU (U200.32), SAMV71_Xplained_Ultra_EDBG (R910.1), SAMV71_Xplained_Ultra_Connectors (J402.13), SAMV71_Xplained_Ultra_Shield_Connectors (J507.27)
PA23: SAMV71_Xplained_Ultra_Target_MCU (U200.46), SAMV71_Xplained_Ultra_EDBG (R912.1), SAMV71_Xplained_Ultra_MCU_Peripherals (D301.1)
PA24: SAMV71_Xplained_Ultra_Target_MCU (U200.56), SAMV71_Xplained_Ultra_Connectors (J400.16 J402.10), SAMV71_Xplained_Ultra_Shield_Connectors (J507.26)
PA25: SAMV71_Xplained_Ultra_Target_MCU (U200.59), SAMV71_Xplained_Ultra_Memory (J600.5), SAMV71_Xplained_Ultra_Shield_Connectors (J507.25)
PA26: SAMV71_Xplained_Ultra_Target_MCU (U200.62), SAMV71_Xplained_Ultra_Memory (J600.9 R608.1)
PA27: SAMV71_Xplained_Ultra_Target_MCU (U200.70), SAMV71_Xplained_Ultra_Connectors (J400.25), SAMV71_Xplained_Ultra_Memory (J600.1 R607.1)
PA28: SAMV71_Xplained_Ultra_Target_MCU (U200.112), SAMV71_Xplained_Ultra_Memory (J600.2 R606.1)
PA29: SAMV71_Xplained_Ultra_Target_MCU (U200.129), SAMV71_Xplained_Ultra_Ethernet (U700.32)
PA30: SAMV71_Xplained_Ultra_Target_MCU (U200.116), SAMV71_Xplained_Ultra_Memory (J600.7 R610.1)
PA31: SAMV71_Xplained_Ultra_Target_MCU (U200.118), SAMV71_Xplained_Ultra_Memory (J600.8 R609.1)
PB02: SAMV71_Xplained_Ultra_Target_MCU (U200.26), SAMV71_Xplained_Ultra_Connectors (J401.6 J405.34), SAMV71_Xplained_Ultra_Shield_Connectors (J504.8 J507.20)
PB03: SAMV71_Xplained_Ultra_Target_MCU (U200.31), SAMV71_Xplained_Ultra_Connectors (J400.20 J401.5 J405.27), SAMV71_Xplained_Ultra_Shield_Connectors (J504.7 J507.21)
PB04: SAMV71_Xplained_Ultra_Target_MCU (U200.105), SAMV71_Xplained_Ultra_EDBG (U900.F9), SAMV71_Xplained_Ultra_Connectors (J402.14 J405.2), SAMV71_Xplained_Ultra_Shield_Connectors (J507.28)
PB05: SAMV71_Xplained_Ultra_Target_MCU (U200.109), SAMV71_Xplained_Ultra_EDBG (R921.2), SAMV71_Xplained_Ultra_Connectors (J403.6 J405.10 R403.2)
PB06_SWDIO: SAMV71_Xplained_Ultra_Target_MCU (U200.79), SAMV71_Xplained_Ultra_EDBG (R905.2), SAMV71_Xplained_Ultra_Connectors (J403.2 R400.2)
PB07_SWCLK: SAMV71_Xplained_Ultra_Target_MCU (U200.89), SAMV71_Xplained_Ultra_EDBG (R904.2), SAMV71_Xplained_Ultra_Connectors (J403.4 R401.2)
PB08_XOUT: SAMV71_Xplained_Ultra_Target_MCU (U200.141), SAMV71_Xplained_Ultra_MCU_Peripherals (C302.1 J301.2)
PB09_XIN: SAMV71_Xplained_Ultra_Target_MCU (U200.142), SAMV71_Xplained_Ultra_MCU_Peripherals (C303.1 XC301.1)
PB12: SAMV71_Xplained_Ultra_Target_MCU (J200.2 U200.87), SAMV71_Xplained_Ultra_EDBG (R900.2), SAMV71_Xplained_Ultra_MCU_Peripherals (R301.2)
PB13: SAMV71_Xplained_Ultra_Target_MCU (U200.144), SAMV71_Xplained_Ultra_Connectors (J400.5), SAMV71_Xplained_Ultra_Shield_Connectors (J504.5)
PC00: SAMV71_Xplained_Ultra_Target_MCU (U200.11), SAMV71_Xplained_Ultra_Connectors (J404.3), SAMV71_Xplained_Ultra_Memory (U601.A6)
PC01: SAMV71_Xplained_Ultra_Target_MCU (U200.38), SAMV71_Xplained_Ultra_Connectors (J404.4), SAMV71_Xplained_Ultra_Memory (U601.B7)
PC02: SAMV71_Xplained_Ultra_Target_MCU (U200.39), SAMV71_Xplained_Ultra_Connectors (J404.5), SAMV71_Xplained_Ultra_Memory (U601.C7)
PC03: SAMV71_Xplained_Ultra_Target_MCU (U200.40), SAMV71_Xplained_Ultra_Connectors (J404.6), SAMV71_Xplained_Ultra_Memory (U601.D7)
PC04: SAMV71_Xplained_Ultra_Target_MCU (U200.41), SAMV71_Xplained_Ultra_Connectors (J404.8), SAMV71_Xplained_Ultra_Memory (U601.D6)
PC05: SAMV71_Xplained_Ultra_Target_MCU (U200.58), SAMV71_Xplained_Ultra_Connectors (J404.9), SAMV71_Xplained_Ultra_Memory (U601.E7)
PC06: SAMV71_Xplained_Ultra_Target_MCU (U200.54), SAMV71_Xplained_Ultra_Connectors (J404.10), SAMV71_Xplained_Ultra_Memory (U601.F7)
PC07: SAMV71_Xplained_Ultra_Target_MCU (U200.48), SAMV71_Xplained_Ultra_Connectors (J404.11), SAMV71_Xplained_Ultra_Memory (U601.G7)
PC08: SAMV71_Xplained_Ultra_Target_MCU (U200.82), SAMV71_Xplained_Ultra_Connectors (J404.35)
PC09_LED: SAMV71_Xplained_Ultra_Target_MCU (J202.1), SAMV71_Xplained_Ultra_Connectors (J404.46), SAMV71_Xplained_Ultra_Shield_Connectors (J500.2), SAMV71_Xplained_Ultra_MCU_Peripherals (D300.1)
PC09_VBUS_DETECT: SAMV71_Xplained_Ultra_Target_MCU (J202.3), SAMV71_Xplained_Ultra_MCU_Peripherals (R305.1 R306.2)
PC11: SAMV71_Xplained_Ultra_Target_MCU (U200.94), SAMV71_Xplained_Ultra_Connectors (J404.36)
PC12: SAMV71_Xplained_Ultra_Target_MCU (U200.17), SAMV71_Xplained_Ultra_Shield_Connectors (J507.33), SAMV71_Xplained_Ultra_CAN (C1001.1 U1000.4)
PC13: SAMV71_Xplained_Ultra_Target_MCU (U200.19), SAMV71_Xplained_Ultra_Connectors (J402.4 J404.47), SAMV71_Xplained_Ultra_Shield_Connectors (J502.5)
PC14: SAMV71_Xplained_Ultra_Target_MCU (U200.97), SAMV71_Xplained_Ultra_Shield_Connectors (J507.34), SAMV71_Xplained_Ultra_CAN (U1000.1)
PC15: SAMV71_Xplained_Ultra_Target_MCU (U200.18), SAMV71_Xplained_Ultra_Memory (R604.2 U601.L7)
PC16: SAMV71_Xplained_Ultra_Target_MCU (U200.100), SAMV71_Xplained_Ultra_MCU_Peripherals (R307.2)
PC17: SAMV71_Xplained_Ultra_Target_MCU (U200.103), SAMV71_Xplained_Ultra_Power_Converter (Q106.1 R127.1)
PC18: SAMV71_Xplained_Ultra_Target_MCU (U200.111), SAMV71_Xplained_Ultra_Memory (U601.J6)
PC19: SAMV71_Xplained_Ultra_Target_MCU (U200.117), SAMV71_Xplained_Ultra_Connectors (J400.6 J402.7), SAMV71_Xplained_Ultra_Shield_Connectors (J503.7)
PC20: SAMV71_Xplained_Ultra_Target_MCU (U200.120), SAMV71_Xplained_Ultra_Memory (U601.N6)
PC21: SAMV71_Xplained_Ultra_Target_MCU (U200.122), SAMV71_Xplained_Ultra_Memory (U601.P7)
PC22: SAMV71_Xplained_Ultra_Target_MCU (U200.124), SAMV71_Xplained_Ultra_Memory (U601.P6)
PC23: SAMV71_Xplained_Ultra_Target_MCU (U200.127), SAMV71_Xplained_Ultra_Memory (U601.R6)
PC24: SAMV71_Xplained_Ultra_Target_MCU (U200.130), SAMV71_Xplained_Ultra_Memory (U601.R2)
PC25: SAMV71_Xplained_Ultra_Target_MCU (U200.133), SAMV71_Xplained_Ultra_Memory (U601.P2)
PC26: SAMV71_Xplained_Ultra_Target_MCU (U200.13), SAMV71_Xplained_Ultra_Memory (U601.P1)
PC27: SAMV71_Xplained_Ultra_Target_MCU (U200.12), SAMV71_Xplained_Ultra_Memory (U601.N2)
PC28: SAMV71_Xplained_Ultra_Target_MCU (U200.76), SAMV71_Xplained_Ultra_Memory (U601.N1)
PC29: SAMV71_Xplained_Ultra_Target_MCU (U200.16), SAMV71_Xplained_Ultra_Memory (U601.M2)
PC30: SAMV71_Xplained_Ultra_Target_MCU (U200.15), SAMV71_Xplained_Ultra_Connectors (J401.8 J404.33)
PC31: SAMV71_Xplained_Ultra_Target_MCU (U200.14), SAMV71_Xplained_Ultra_Connectors (J401.3), SAMV71_Xplained_Ultra_Shield_Connectors (J502.2)
PD00: SAMV71_Xplained_Ultra_Target_MCU (U200.1), SAMV71_Xplained_Ultra_Ethernet (R711.1 U700.19), SAMV71_Xplained_Ultra_Shield_Connectors (J504.6)
PD01: SAMV71_Xplained_Ultra_Target_MCU (U200.132), SAMV71_Xplained_Ultra_Ethernet (U700.21)
PD02: SAMV71_Xplained_Ultra_Target_MCU (U200.131), SAMV71_Xplained_Ultra_Ethernet (U700.22)
PD03: SAMV71_Xplained_Ultra_Target_MCU (U200.128), SAMV71_Xplained_Ultra_Ethernet (U700.23)
PD04: SAMV71_Xplained_Ultra_Target_MCU (U200.126), SAMV71_Xplained_Ultra_Connectors (J403.14), SAMV71_Xplained_Ultra_Ethernet (R713.1 R718.2 U700.13)
PD05: SAMV71_Xplained_Ultra_Target_MCU (U200.125), SAMV71_Xplained_Ultra_Connectors (J403.16), SAMV71_Xplained_Ultra_Ethernet (R705.1 R719.1 U700.18)
PD06: SAMV71_Xplained_Ultra_Target_MCU (U200.121), SAMV71_Xplained_Ultra_Connectors (J403.18), SAMV71_Xplained_Ultra_Ethernet (R708.1 R715.1 U700.17)
PD07: SAMV71_Xplained_Ultra_Target_MCU (U200.119), SAMV71_Xplained_Ultra_Connectors (J403.20), SAMV71_Xplained_Ultra_Ethernet (R707.1 R714.1 U700.12)
PD08: SAMV71_Xplained_Ultra_Target_MCU (U200.113), SAMV71_Xplained_Ultra_Connectors (J403.12), SAMV71_Xplained_Ultra_Ethernet (U700.11)
PD09: SAMV71_Xplained_Ultra_Target_MCU (U200.110), SAMV71_Xplained_Ultra_Ethernet (R700.1 U700.10)
PD10: SAMV71_Xplained_Ultra_Target_MCU (U200.101), SAMV71_Xplained_Ultra_Connectors (J405.6)
PD11: SAMV71_Xplained_Ultra_Target_MCU (R200.1 U200.98), SAMV71_Xplained_Ultra_Connectors (J400.23 J402.6), SAMV71_Xplained_Ultra_Shield_Connectors (J503.6)
PD12: SAMV71_Xplained_Ultra_Target_MCU (U200.92), SAMV71_Xplained_Ultra_EDBG (U900.G5), SAMV71_Xplained_Ultra_Connectors (J400.24)
PD13: SAMV71_Xplained_Ultra_Target_MCU (U200.88), SAMV71_Xplained_Ultra_Memory (U601.N7)
PD14: SAMV71_Xplained_Ultra_Target_MCU (U200.84), SAMV71_Xplained_Ultra_Memory (U601.L1)
PD15: SAMV71_Xplained_Ultra_Target_MCU (U200.106), SAMV71_Xplained_Ultra_Memory (U601.J2), SAMV71_Xplained_Ultra_Shield_Connectors (J505.5)
PD16: SAMV71_Xplained_Ultra_Target_MCU (R234.1 U200.78), SAMV71_Xplained_Ultra_Memory (U601.K6)
PD17: SAMV71_Xplained_Ultra_Target_MCU (U200.74), SAMV71_Xplained_Ultra_Memory (U601.K7)
PD18: SAMV71_Xplained_Ultra_Target_MCU (U200.69), SAMV71_Xplained_Ultra_Memory (J600.10 R611.1), SAMV71_Xplained_Ultra_Shield_Connectors (J505.3 J507.8)
PD19: SAMV71_Xplained_Ultra_Target_MCU (U200.67), SAMV71_Xplained_Ultra_Connectors (J404.34), SAMV71_Xplained_Ultra_Shield_Connectors (J505.4 J507.7)
PD20: SAMV71_Xplained_Ultra_Target_MCU (U200.65), SAMV71_Xplained_Ultra_EDBG (R915.2), SAMV71_Xplained_Ultra_Connectors (J401.17 J402.17), SAMV71_Xplained_Ultra_Shield_Connectors (J500.5 J506.1)
PD21: SAMV71_Xplained_Ultra_Target_MCU (R230.1 U200.63), SAMV71_Xplained_Ultra_EDBG (U900.K3), SAMV71_Xplained_Ultra_Connectors (J400.19 J401.16 J402.16), SAMV71_Xplained_Ultra_Shield_Connectors (J500.4 J506.4)
PD23: SAMV71_Xplained_Ultra_Target_MCU (U200.57), SAMV71_Xplained_Ultra_Memory (U601.K2)
PD24: SAMV71_Xplained_Ultra_Target_MCU (R219.1 R223.1 U200.55), SAMV71_Xplained_Ultra_Connectors (J400.14)
PD25: SAMV71_Xplained_Ultra_Target_MCU (U200.52), SAMV71_Xplained_Ultra_Connectors (J400.12 J401.15), SAMV71_Xplained_Ultra_Shield_Connectors (J500.3)
PD27: SAMV71_Xplained_Ultra_Target_MCU (U200.47), SAMV71_Xplained_Ultra_Connectors (J400.26 J402.15), SAMV71_Xplained_Ultra_Shield_Connectors (J503.5 J505.2)
PD28: SAMV71_Xplained_Ultra_Target_MCU (R203.2 U200.71), SAMV71_Xplained_Ultra_EDBG (R913.1), SAMV71_Xplained_Ultra_Connectors (J400.27 J401.9), SAMV71_Xplained_Ultra_Shield_Connectors (J503.1 J505.1)
PD29: SAMV71_Xplained_Ultra_Target_MCU (U200.108), SAMV71_Xplained_Ultra_Memory (U601.J7)
PD30: SAMV71_Xplained_Ultra_Target_MCU (U200.34), SAMV71_Xplained_Ultra_Connectors (J400.28 J402.3), SAMV71_Xplained_Ultra_Shield_Connectors (J502.4 J503.2)
PD31: SAMV71_Xplained_Ultra_Target_MCU (U200.2), SAMV71_Xplained_Ultra_Connectors (J400.29), SAMV71_Xplained_Ultra_Memory (U604.7)
PE00: SAMV71_Xplained_Ultra_Target_MCU (R216.1 U200.4), SAMV71_Xplained_Ultra_Connectors (J404.13), SAMV71_Xplained_Ultra_Memory (U601.G1)
PE01: SAMV71_Xplained_Ultra_Target_MCU (U200.6), SAMV71_Xplained_Ultra_Connectors (J404.14), SAMV71_Xplained_Ultra_Memory (U601.F1)
PE02: SAMV71_Xplained_Ultra_Target_MCU (U200.7), SAMV71_Xplained_Ultra_Connectors (J404.15), SAMV71_Xplained_Ultra_Memory (U601.E1)
PE03: SAMV71_Xplained_Ultra_Target_MCU (R217.1 U200.10), SAMV71_Xplained_Ultra_Connectors (J404.16), SAMV71_Xplained_Ultra_Memory (U601.D2)
PE04: SAMV71_Xplained_Ultra_Target_MCU (R218.1 U200.27), SAMV71_Xplained_Ultra_Connectors (J404.18), SAMV71_Xplained_Ultra_Memory (U601.D1)
PE05: SAMV71_Xplained_Ultra_Target_MCU (R222.1 U200.28), SAMV71_Xplained_Ultra_Connectors (J404.19), SAMV71_Xplained_Ultra_Memory (U601.C1)
TARGET_RESET: SAMV71_Xplained_Ultra_Target_MCU (U200.83), SAMV71_Xplained_Ultra_Connectors (J403.10 R402.2), SAMV71_Xplained_Ultra_Power_Supply (5 pins), SAMV71_Xplained_Ultra_Shield_Connectors (J501.3 J506.5)
TARGET_RESET_SENSE: SAMV71_Xplained_Ultra_EDBG (U900.H2), SAMV71_Xplained_Ultra_Power_Supply (R139.1 R141.1)
TARGET_USB_ID: SAMV71_Xplained_Ultra_Power_Multiplexer (R121.1 U103.4), SAMV71_Xplained_Ultra_MCU_Peripherals (J302.4 R307.1)
TARGET_USB_N: SAMV71_Xplained_Ultra_Target_MCU (U200.136), SAMV71_Xplained_Ultra_MCU_Peripherals (D302.3 J302.2)
TARGET_USB_P: SAMV71_Xplained_Ultra_Target_MCU (U200.137), SAMV71_Xplained_Ultra_MCU_Peripherals (D302.2 J302.3)
VBAT: SAMV71_Xplained_Ultra_Power_Supply (R112.1), SAMV71_Xplained_Ultra_Shield_Connectors (J501.1)

## Assembly variants
Default_assembly: not fitted C304 C601 C602 C800 C806 C807 C903 R112 R216 R217 R218 R222 R304 R705 R707 R708 R709 R717 R718 R720 R809 R810 R812 R813 R919 U602 U603